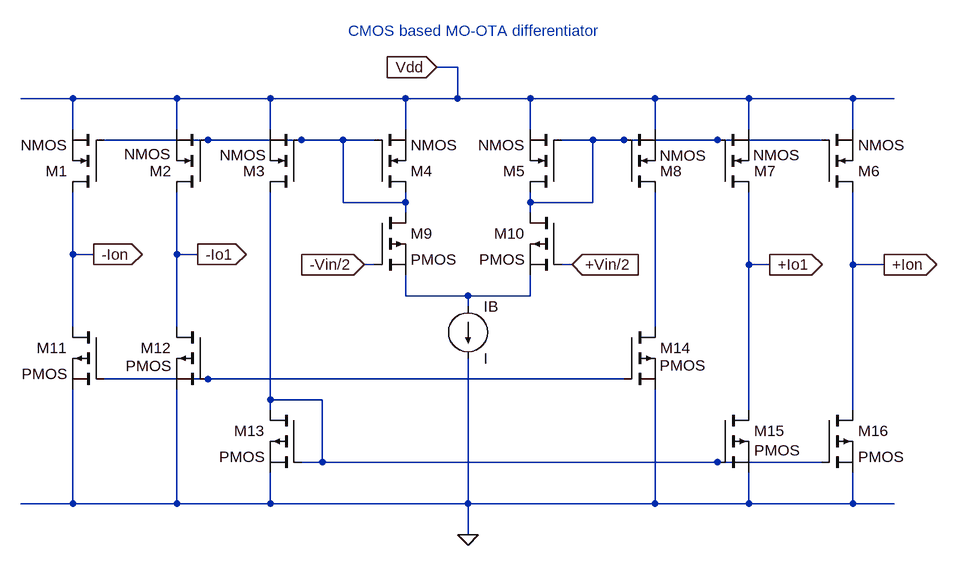
[diagram p0: schematic differentiator_CMOS_MO_OTA.asc]
differentiator_CMOS_MO_OTA.asc, the LTspice schematic file:
Version 4
SHEET 1 1552 788
WIRE 688 -48 656 -48
WIRE 96 0 16 0
WIRE 256 0 96 0
WIRE 400 0 256 0
WIRE 608 0 400 0
WIRE 688 0 688 -48
WIRE 688 0 608 0
WIRE 800 0 688 0
WIRE 992 0 800 0
WIRE 1136 0 992 0
WIRE 1296 0 1136 0
WIRE 1360 0 1296 0
WIRE 96 48 96 0
WIRE 256 48 256 0
WIRE 400 48 400 0
WIRE 608 48 608 0
WIRE 800 48 800 0
WIRE 992 48 992 0
WIRE 1136 48 1136 0
WIRE 1296 48 1296 0
WIRE 304 64 144 64
WIRE 448 64 304 64
WIRE 512 64 448 64
WIRE 560 64 512 64
WIRE 896 64 848 64
WIRE 944 64 896 64
WIRE 1088 64 944 64
WIRE 1248 64 1088 64
WIRE 512 160 512 64
WIRE 608 160 608 144
WIRE 608 160 512 160
WIRE 800 160 800 144
WIRE 896 160 896 64
WIRE 896 160 800 160
WIRE 608 176 608 160
WIRE 800 176 800 160
WIRE 96 240 96 144
WIRE 128 240 96 240
WIRE 256 240 256 144
WIRE 288 240 256 240
WIRE 560 256 544 256
WIRE 864 256 848 256
WIRE 1136 256 1136 144
WIRE 1168 256 1136 256
WIRE 1296 256 1296 144
WIRE 1344 256 1296 256
WIRE 608 304 608 272
WIRE 704 304 608 304
WIRE 800 304 800 272
WIRE 800 304 704 304
WIRE 704 320 704 304
WIRE 96 352 96 240
WIRE 256 352 256 240
WIRE 992 352 992 144
WIRE 304 432 144 432
WIRE 944 432 304 432
WIRE 400 464 400 144
WIRE 480 464 400 464
WIRE 400 480 400 464
WIRE 1136 480 1136 256
WIRE 1296 480 1296 256
WIRE 480 560 480 464
WIRE 480 560 448 560
WIRE 1088 560 480 560
WIRE 1248 560 1088 560
WIRE 96 624 96 448
WIRE 96 624 16 624
WIRE 256 624 256 448
WIRE 256 624 96 624
WIRE 400 624 400 576
WIRE 400 624 256 624
WIRE 704 624 704 400
WIRE 704 624 400 624
WIRE 992 624 992 448
WIRE 992 624 704 624
WIRE 1136 624 1136 576
WIRE 1136 624 992 624
WIRE 1296 624 1296 576
WIRE 1296 624 1136 624
WIRE 1360 624 1296 624
WIRE 704 672 704 624
FLAG 704 672 0
FLAG 656 -48 Vdd
IOPIN 656 -48 In
FLAG 128 240 -Ion
IOPIN 128 240 Out
FLAG 288 240 -Io1
IOPIN 288 240 Out
FLAG 544 256 -Vin/2
IOPIN 544 256 In
FLAG 864 256 +Vin/2
IOPIN 864 256 In
FLAG 1168 256 +Io1
IOPIN 1168 256 Out
FLAG 1344 256 +Ion
IOPIN 1344 256 Out
SYMBOL nmos 144 144 R180
SYMATTR InstName M1
SYMBOL nmos 304 144 R180
WINDOW 3 57 58 Left 2
SYMATTR InstName M2
SYMBOL nmos 448 144 R180
WINDOW 3 54 57 Left 2
SYMATTR InstName M3
SYMBOL nmos 560 144 M180
SYMATTR InstName M4
SYMBOL nmos 848 144 R180
SYMATTR InstName M5
SYMBOL nmos 1248 144 M180
SYMATTR InstName M6
SYMBOL nmos 1088 144 M180
WINDOW 3 55 57 Left 2
SYMATTR InstName M7
SYMBOL nmos 944 144 M180
WINDOW 3 55 56 Left 2
SYMATTR InstName M8
SYMBOL pmos 560 176 R0
SYMATTR InstName M9
SYMBOL pmos 848 176 M0
SYMATTR InstName M10
SYMBOL pmos 144 352 M0
SYMATTR InstName M11
SYMBOL pmos 304 352 M0
WINDOW 3 56 60 Left 2
SYMATTR InstName M12
SYMBOL pmos 448 480 M0
SYMATTR InstName M13
SYMBOL pmos 944 352 R0
WINDOW 3 55 59 Left 2
SYMATTR InstName M14
SYMBOL pmos 1088 480 R0
WINDOW 3 56 62 Left 2
SYMATTR InstName M15
SYMBOL pmos 1248 480 R0
SYMATTR InstName M16
SYMBOL current 704 320 R0
SYMATTR InstName IB
TEXT 520 -104 Left 2 ;CMOS based MO-OTA differentiator

The netlist it stands for:
* differentiator_CMOS_MO_OTA.asc
M1 -Ion N001 Vdd Vdd NMOS
M2 -Io1 N001 Vdd Vdd NMOS
M3 N006 N001 Vdd Vdd NMOS
M4 N001 N001 Vdd Vdd NMOS
M5 N002 N002 Vdd Vdd NMOS
M6 +Ion N002 Vdd Vdd NMOS
M7 +Io1 N002 Vdd Vdd NMOS
M8 N004 N002 Vdd Vdd NMOS
M9 N001 -Vin/2 N003 N003 PMOS
M10 N002 +Vin/2 N003 N003 PMOS
M11 -Ion N005 0 0 PMOS
M12 -Io1 N005 0 0 PMOS
M13 N006 N006 0 0 PMOS
M14 N004 N005 0 0 PMOS
M15 +Io1 N006 0 0 PMOS
M16 +Ion N006 0 0 PMOS
IB N003 0 I
.model NMOS NMOS
.model PMOS PMOS
.lib standard.mos
* CMOS based MO-OTA differentiator
.backanno
.end